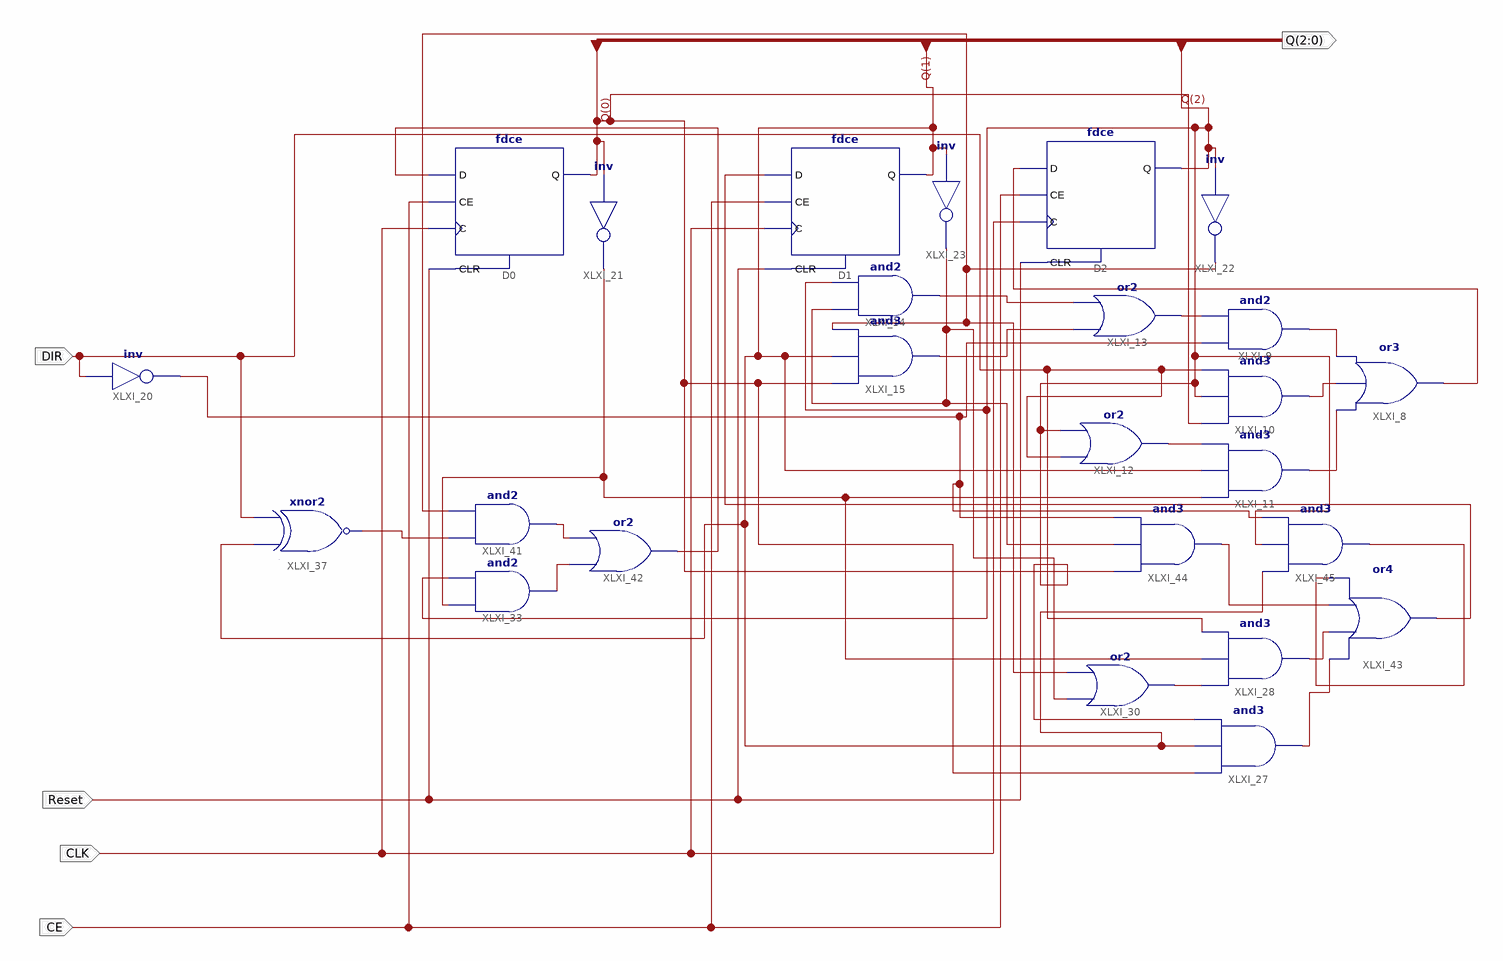
[diagram p0: schematic sheet 1]
// Xilinx ISE schematic schemat.sch (xc9500xl) as structural Verilog: 25 symbols, 5 ports
module schemat (
  input  CLK,
  input  Reset,
  input  DIR,
  input  CE,
  output [2:0] Q
);

  wire XLXN_51, XLXN_52, XLXN_53, XLXN_54, XLXN_58, XLXN_59, XLXN_60, XLXN_65, XLXN_79, XLXN_81, XLXN_83,
       XLXN_84, XLXN_86, XLXN_93, XLXN_94, XLXN_95, XLXN_96, XLXN_100, XLXN_104, XLXN_105, XLXN_107, XLXN_108;

  fdce D0 (.C(CLK), .CE(CE), .CLR(Reset), .D(XLXN_96), .Q(Q[0]));
  fdce D1 (.C(CLK), .CE(CE), .CLR(Reset), .D(XLXN_84), .Q(Q[1]));
  fdce D2 (.C(CLK), .CE(CE), .CLR(Reset), .D(XLXN_65), .Q(Q[2]));
  or XLXI_12 (XLXN_54, DIR, Q[2]);
  or XLXI_13 (XLXN_58, XLXN_60, XLXN_59);
  and XLXI_14 (XLXN_59, XLXN_86, Q[2]);
  and XLXI_15 (XLXN_60, Q[0], Q[1], XLXN_104);
  or XLXI_8 (XLXN_65, XLXN_53, XLXN_52, XLXN_51);
  and XLXI_9 (XLXN_51, XLXN_108, XLXN_58);
  and XLXI_10 (XLXN_52, Q[0], Q[2], DIR);
  and XLXI_11 (XLXN_53, XLXN_100, Q[1], XLXN_54);
  not XLXI_20 (XLXN_108, DIR);
  not XLXI_21 (XLXN_100, Q[0]);
  not XLXI_22 (XLXN_104, Q[2]);
  not XLXI_23 (XLXN_86, Q[1]);
  and XLXI_27 (XLXN_81, Q[0], Q[1], Q[2]);
  and XLXI_28 (XLXN_79, XLXN_83, XLXN_100, DIR);
  or XLXI_30 (XLXN_83, XLXN_86, XLXN_104);
  and XLXI_33 (XLXN_95, XLXN_100, Q[2]);
  xnor XLXI_37 (XLXN_93, Q[1], DIR);
  and XLXI_41 (XLXN_94, XLXN_93, XLXN_104);
  or XLXI_42 (XLXN_96, XLXN_95, XLXN_94);
  or XLXI_43 (XLXN_84, XLXN_81, XLXN_79, XLXN_107, XLXN_105);
  and XLXI_44 (XLXN_107, Q[0], XLXN_86, XLXN_108);
  and XLXI_45 (XLXN_105, Q[1], Q[2], XLXN_108);
endmodule
